# Altium schematic sheet Agrobot_2.0.SchDoc: Kapitoshka
size 594 x 420 mm; ApprovedBy: Алексеев; CheckedBy: Алексеев; DrawnBy: Подлесный; DocumentNumber: СКТБ.280317.002 Э3; SheetNumber: 1; Format: A2; DocumentType: Схема электрическая принципиальная; ImagePath: Введите номер платы
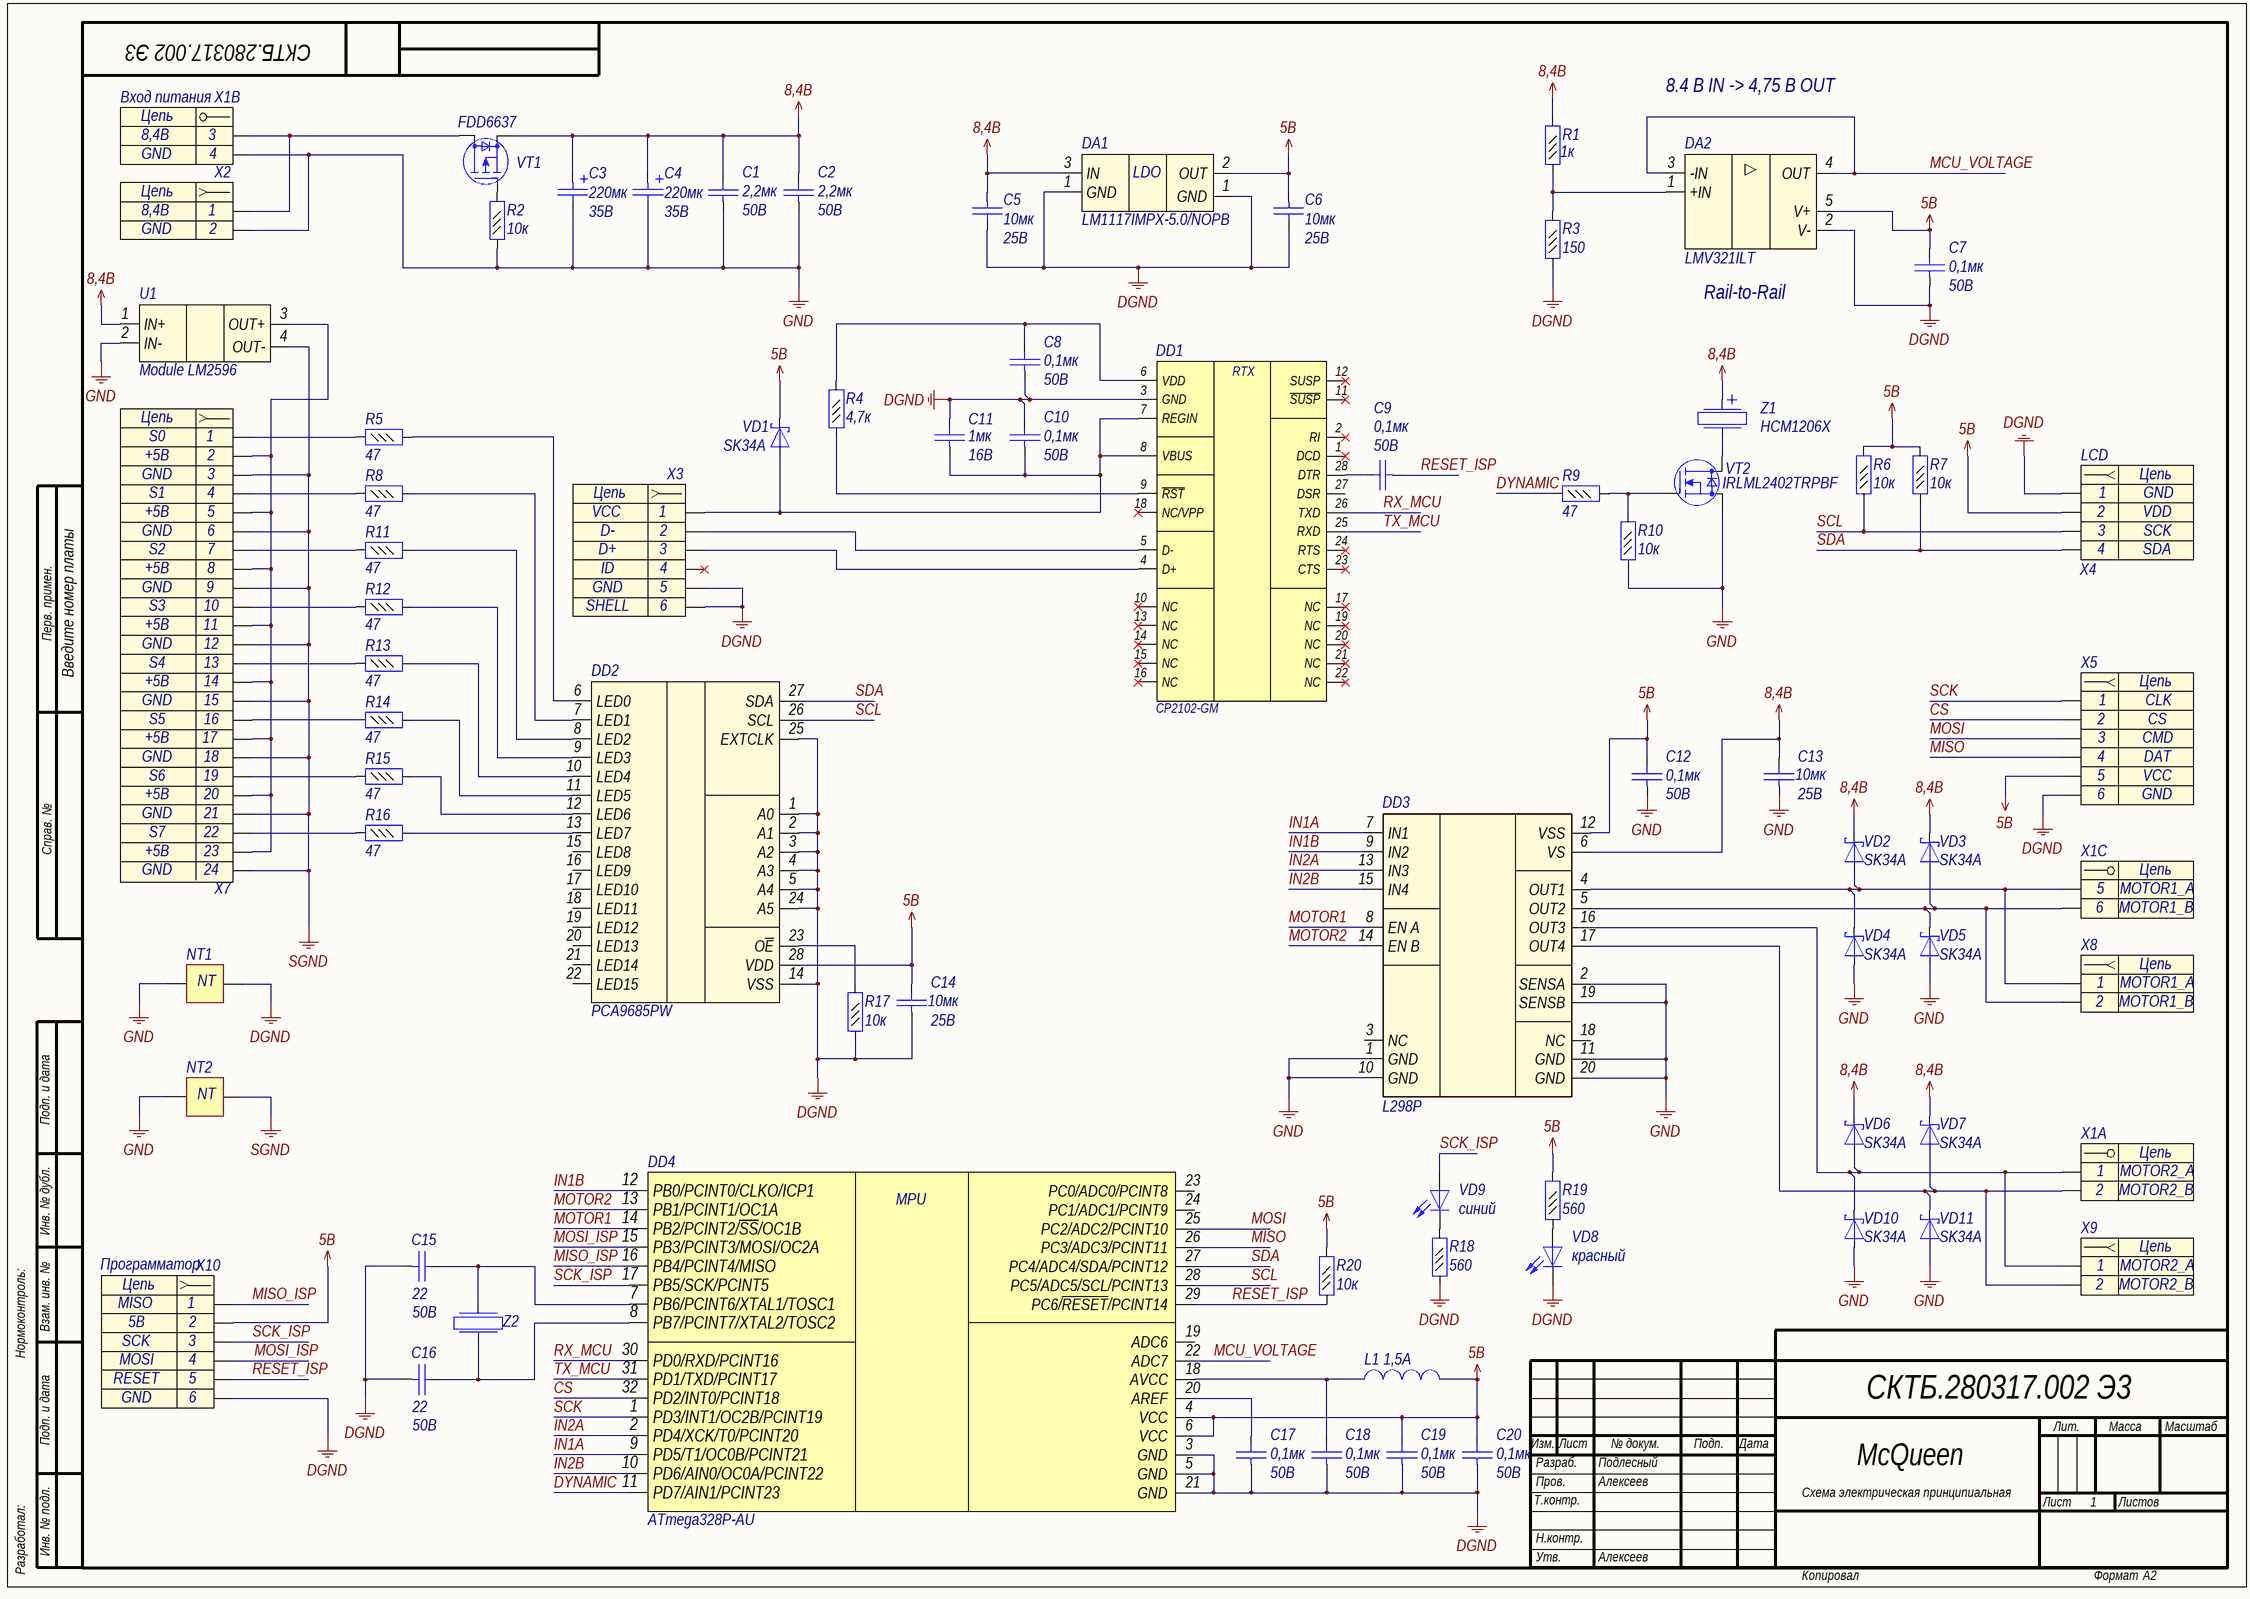
[diagram p0: Agrobot_2.0.SchDoc]

## Parts
C1  value 2,2мк  Voltage: 50В  [C1206]  (hidden comment: Capacitor)
C2  value 2,2мк  Voltage: 50В  [C1206]  (hidden comment: Capacitor)
C3  value 220мк  Voltage: 35В  [K50-35(8X11.5)_H]  (hidden comment: Capacitor_pol)
C4  value 220мк  Voltage: 35В  [K50-35(8X11.5)_H_MIRROR]  (hidden comment: Capacitor_pol)
C5  Voltage: 25В  [C1210]  (hidden comment: 10мк)
C6  Voltage: 25В  [C1210]  (hidden comment: 10мк)
C7  Voltage: 50B  [C0603]  (hidden comment: 0,1мк)
C8  Voltage: 50B  [C0603]  (hidden comment: 0,1мк)
C9  Voltage: 50B  [C0603]  (hidden comment: 0,1мк)
C10  Voltage: 50B  [C0603]  (hidden comment: 0,1мк)
C11  Voltage: 16B  [C0603]  (hidden comment: 1мк)
C12  Voltage: 50B  [C0603]  (hidden comment: 0,1мк)
C13  value 10мк  Voltage: 25В  [C1210]  (hidden comment: Capacitor)
C14  value 10мк  Voltage: 25В  [C1210]  (hidden comment: Capacitor)
C15  Voltage: 50B  [C0603]  (hidden comment: 22)
C16  Voltage: 50B  [C0603]  (hidden comment: 22)
C17  Voltage: 50B  [C0603]  (hidden comment: 0,1мк)
C18  Voltage: 50B  [C0603]  (hidden comment: 0,1мк)
C19  Voltage: 50B  [C0603]  (hidden comment: 0,1мк)
C20  Voltage: 50B  [C0603]  (hidden comment: 0,1мк)
DA1  Part Number: LM1117IMPX-5.0/NOPB  [SOT-223]  (hidden comment: LM1117IMPX)
DA2  LMV321ILT  [SOT23-5]
DD1  CP2102-GM  [QFN28]
DD2  PCA9685PW  [TSSOP28]
DD3  L298P  [POWERSO20]
DD4  ATmega328P-AU  [TQFP-32]
L1  Rated Current: 1,5A  [L0603]  (hidden comment: Inductor)
NT1  Pofigistor  [Pofigistor0603]  (value not drawn)  (net tie, no BOM)
NT2  Pofigistor  [Pofigistor0603]  (value not drawn)  (net tie, no BOM)
R1  value 1к  [R0603]  (hidden comment: Resistor_0,062Вт)
R2  value 10к  [R0603]  (hidden comment: Resistor_0,062Вт)
R3  value 150  [R0603]  (hidden comment: Resistor_0,062Вт)
R4  value 4,7к  [R0603]  (hidden comment: Resistor_0,062Вт)
R5  value 47  [R0603]  (hidden comment: Resistor_0,062Вт)
R6  value 10к  [R0603]  (hidden comment: Resistor_0,062Вт)
R7  value 10к  [R0603]  (hidden comment: Resistor_0,062Вт)
R8  value 47  [R0603]  (hidden comment: Resistor_0,062Вт)
R9  value 47  [R0603]  (hidden comment: Resistor_0,062Вт)
R10  value 10к  [R0603]  (hidden comment: Resistor_0,062Вт)
R11  value 47  [R0603]  (hidden comment: Resistor_0,062Вт)
R12  value 47  [R0603]  (hidden comment: Resistor_0,062Вт)
R13  value 47  [R0603]  (hidden comment: Resistor_0,062Вт)
R14  value 47  [R0603]  (hidden comment: Resistor_0,062Вт)
R15  value 47  [R0603]  (hidden comment: Resistor_0,062Вт)
R16  value 47  [R0603]  (hidden comment: Resistor_0,062Вт)
R17  value 10к  [R0603]  (hidden comment: Resistor_0,062Вт)
R18  value 560  [R0603]  (hidden comment: Resistor_0,062Вт)
R19  value 560  [R0603]  (hidden comment: Resistor_0,062Вт)
R20  value 10к  [R0603]  (hidden comment: Resistor_0,062Вт)
U1  Module LM2596  [module LM2596]
VD1  Part Number: SK34A  [SMA]  (hidden comment: DiodeSchottky)
VD2  Part Number: SK34A  [SMA]  (hidden comment: DiodeSchottky)
VD3  Part Number: SK34A  [SMA]  (hidden comment: DiodeSchottky)
VD4  Part Number: SK34A  [SMA]  (hidden comment: DiodeSchottky)
VD5  Part Number: SK34A  [SMA]  (hidden comment: DiodeSchottky)
VD6  Part Number: SK34A  [SMA]  (hidden comment: DiodeSchottky)
VD7  Part Number: SK34A  [SMA]  (hidden comment: DiodeSchottky)
VD8  красный  [L_0805]
VD9  синий  [L_0805]
VD10  Part Number: SK34A  [SMA]  (hidden comment: DiodeSchottky)
VD11  Part Number: SK34A  [SMA]  (hidden comment: DiodeSchottky)
VT1  Part Number: FDD6637  [DPAK]  (hidden comment: P-MOSFET)
VT2  Part Number: IRLML2402TRPBF  [SOT23-3]  (hidden comment: N-MOSFET)
X1  (no value)  [TERMINAL-6WAY-5MM]  (parts A,B,C of 3)
X2  Header_2_sct  [2HOLE_2.5]  (value not drawn)
X3  Header_6_sct  [USB_MICRO_VERT]  (value not drawn)
X4  LCD  [PLS-4HOLES]
X5  Header_6_sct  [PSP_ANTENNA]  (value not drawn)
X7  Header_24_sct  [PLS-24-3]  (value not drawn)
X8  Header_2_sct  [2HOLE_2.5]  (value not drawn)
X9  Header_2_sct  [2HOLE_2.5]  (value not drawn)
X10  Программатор  [PLS2-6]
Z1  Part Number: HCM1206X  [Buzzer_gen_12mm]
Z2  Crystal  [HC-49SM]  (value not drawn)

## Nets
5В: C6.1 C7.2 C12.2 C14.2 C19.2 C20.2 DA1.2(OUT) DA2.5(V+) DD2.28(VDD) DD3.12(VSS) DD4.4(VCC) DD4.6(VCC) L1.2 R6.2 R7.2 R19.2 R20.2 VD1.1(K) X4.2 X5.5 X10.2
8,4В: C1.2 C2.2 C3.1 C4.1 C5.1 C13.2 DA1.3(IN) DD3.6(VS) R1.2 U1.1(IN+) VD2.1(K) VD3.1(K) VD6.1(K) VD7.1(K) VT1.3(S) Z1.1
DGND: C5.2 C6.2 C7.1 C8.1 C10.2 C11.2 C14.1 C15.1 C16.1 C17.1 C18.1 C19.1 C20.1 DA1.1(GND) DA2.2(V-) DD1.3(GND) DD2.1(A0) DD2.2(A1) DD2.3(A2) DD2.4(A3) DD2.5(A4) DD2.14(VSS) DD2.24(A5) DD2.25(EXTCLK) DD4.3(GND) DD4.5(GND) DD4.21(GND) NT1.2 R3.1 R17.1 R18.1 VD8.1(K) X3.5 X3.6 X4.1 X5.6 X10.6
GND: C1.1 C2.1 C3.2 C4.2 C12.1 C13.1 DD3.1(GND) DD3.2(SENSA) DD3.10(GND) DD3.11(GND) DD3.19(SENSB) DD3.20(GND) NT1.1 NT2.1 R2.1 R10.1 U1.2(IN-) VD4.2(A) VD5.2(A) VD10.2(A) VD11.2(A) VT2.2(S) X1.4 X2.2
SGND: NT2.2 U1.4(OUT-) X7.3 X7.6 X7.9 X7.12 X7.15 X7.18 X7.21 X7.24
CS: DD4.32(PD2/INT0/PCINT18) X5.2
DYNAMIC: DD4.11(PD7/AIN1/PCINT23) R9.1
IN1A: DD3.7(IN1) DD4.9(PD5/T1/OC0B/PCINT21)
IN1B: DD3.9(IN2) DD4.12(PB0/PCINT0/CLKO/ICP1)
IN2A: DD3.13(IN3) DD4.2(PD4/XCK/T0/PCINT20)
IN2B: DD3.15(IN4) DD4.10(PD6/AIN0/OC0A/PCINT22)
MCU_VOLTAGE: DA2.3(-IN) DA2.4(OUT) DD4.22(ADC7)
MISO: DD4.26(PC3/ADC3/PCINT11) X5.4
MISO_ISP: DD4.16(PB4/PCINT4/MISO) X10.1
MOSI: DD4.25(PC2/ADC2/PCINT10) X5.3
MOSI_ISP: DD4.15(PB3/PCINT3/MOSI/OC2A) X10.4
MOTOR1: DD3.8(EN_A) DD4.14(PB2/PCINT2/~{SS}/OC1B)
MOTOR2: DD3.14(EN_B) DD4.13(PB1/PCINT1/OC1A)
RESET_ISP: C9.1 DD4.29(PC6/~{RESET}/PCINT14) R20.1 X10.5
RX_MCU: DD1.26(TXD) DD4.30(PD0/RXD/PCINT16)
SCK: DD4.1(PD3/INT1/OC2B/PCINT19) X5.1
SCK_ISP: DD4.17(PB5/SCK/PCINT5) VD9.2(A) X10.3
SCL: DD2.26(SCL) DD4.28(PC5/ADC5/SCL/PCINT13) R6.1 X4.3
SDA: DD2.27(SDA) DD4.27(PC4/ADC4/SDA/PCINT12) R7.1 X4.4
TX_MCU: DD1.25(RXD) DD4.31(PD1/TXD/PCINT17)
NetC8_2: C8.2 DD1.6(VDD) R4.2
NetC9_2: C9.2 DD1.28(DTR)
NetC10_1: C10.1 C11.1 DD1.7(REGIN) DD1.8(VBUS) VD1.2(A) X3.1
NetC15_2: C15.2 DD4.7(PB6/PCINT6/XTAL1/TOSC1) Z2.2
NetC16_2: C16.2 DD4.8(PB7/PCINT7/XTAL2/TOSC2) Z2.1
NetC17_2: C17.2 DD4.20(AREF)
NetC18_2: C18.2 DD4.18(AVCC) L1.1
NetDA2_1: DA2.1(+IN) R1.1 R3.2
NetDD1_4: DD1.4(D+) X3.3
NetDD1_5: DD1.5(D-) X3.2
NetDD1_9: DD1.9(~{RST}) R4.1
NetDD2_6: DD2.6(LED0) R5.2
NetDD2_7: DD2.7(LED1) R8.2
NetDD2_8: DD2.8(LED2) R11.2
NetDD2_9: DD2.9(LED3) R12.2
NetDD2_10: DD2.10(LED4) R13.2
NetDD2_11: DD2.11(LED5) R14.2
NetDD2_12: DD2.12(LED6) R15.2
NetDD2_13: DD2.13(LED7) R16.2
NetDD2_23: DD2.23(O~{E}) R17.2
NetDD3_4: DD3.4(OUT1) VD2.2(A) VD4.1(K) X1.5 X8.1
NetDD3_5: DD3.5(OUT2) VD3.2(A) VD5.1(K) X1.6 X8.2
NetDD3_16: DD3.16(OUT3) VD6.2(A) VD10.1(K) X1.1 X9.1
NetDD3_17: DD3.17(OUT4) VD7.2(A) VD11.1(K) X1.2 X9.2
NetR2_2: R2.2 VT1.1(G)
NetR5_1: R5.1 X7.1
NetR8_1: R8.1 X7.4
NetR9_2: R9.2 R10.2 VT2.1(G)
NetR11_1: R11.1 X7.7
NetR12_1: R12.1 X7.10
NetR13_1: R13.1 X7.13
NetR14_1: R14.1 X7.16
NetR15_1: R15.1 X7.19
NetR16_1: R16.1 X7.22
NetR18_2: R18.2 VD9.1(K)
NetR19_1: R19.1 VD8.2(A)
NetU1_3: U1.3(OUT+) X7.2 X7.5 X7.8 X7.11 X7.14 X7.17 X7.20 X7.23
NetVT1_2: VT1.2(D) X1.3 X2.1
NetVT2_3: VT2.3(D) Z1.2

Not connected (* = marked no-connect by the designer): DD1 1(DCD)* 2(RI)* 10(NC)* 11(~{SUSP})* 12(SUSP)* 13(NC)* 14(NC)* 15(NC)* 16(NC)* 17(NC)* 18(NC/VPP)* 19(NC)* 20(NC)* 21(NC)* 22(NC)* 23(CTS)* 24(RTS)* 27(DSR); DD2 15(LED8) 16(LED9) 17(LED10) 18(LED11) 19(LED12) 20(LED13) 21(LED14) 22(LED15); DD3 3(NC) 18(NC); DD4 19(ADC6) 23(PC0/ADC0/PCINT8) 24(PC1/ADC1/PCINT9); X3 4*

## Notes on the sheet
- 8.4 B IN -> 4,75 B OUT
- Rail-to-Rail
- Перв. примен.
- Справ. №
- Подп. и дата
- Инв. № дубл.
- Нормоконтроль:
- Взам. инв. №
- Изм.
- Лист
- № докум.
- Подп.
- Дата
- Лит.
- Масса
- Масштаб
- Т.контр.
- Пров.
- Разраб.
- McQueen
- Листов
- Разработал:
- Инв. № подл.
- Н.контр.
- Утв.
- Копировал
- Формат
- (in symbol connect0) Цепь
- (in symbol connect9) Цепь
- (in symbol connect10) Цепь
- (in symbol connect11) Цепь
- (in symbol connect11, part A) Цепь
- (in symbol connect11, part B) Цепь
- (in symbol connect11, part C) Цепь
- (in symbol connect13) Цепь
- (in symbol connect131) Цепь
- (in symbol interf33) RTX
- (in symbol microcont1) MPU
- (in symbol pwr129) LDO
- (in symbol res1930) NT

## Library data of the parts
C1 C2 = cap187: Конденсатор; Part Name: Ceramic; Manufacture: Murata; Part Number: GRM31CR71H225KA88**L; id: cap187; TKE: X7R
C3 = cap221: Конденсатор полярный; Part Name: Electrolit; Manufacture: Jamicon; Part Number: TKR221M1VF11; id: cap221; tga: 0,20%
C4 = cap222: Конденсатор полярный; Part Name: Electrolit; Manufacture: Jamicon; Part Number: TKR221M1VF11; id: cap222; tga: 0,20%
C5 C6 = cap193: Конденсатор; Part Name: Ceramic; Manufacture: Murata; Part Number: GRM32ER61A106K; id: cap193; TKE: X7R; Value: 10мк
C7-C10 C12 C17-C20 = cap131: Конденсатор; Part Name: Ceramic; Manufacture: Murata; Part Number: GRM188R71H104KA93D; id: cap131; TKE: X7R; Value: 0,1мк
C11 = cap133: Конденсатор; Part Name: Ceramic; Manufacture: Murata; Part Number: GRM188R71C105KA12D**; id: cap133; TKE: X7R; Value: 1мк
C13 C14 = cap194: Конденсатор; Part Name: Capacitors; Part Number: GRM32ER61A106K; id: cap194; TKE: X7R
C15 C16 = cap77: Конденсатор; Part Name: Ceramic; Manufacture: Yageo; Part Number: CC0603JRNPO9BN220; id: cap77; TKE: NP0; Value: 22
DA1 = pwr129: Low-Dropout Regulator for 5-V to 3.3-V Conversion; Part Name: Linear Regulator with a dropout of 5V at 800mA; Manufacturer: Texas Instruments; id: pwr129; Input Voltage: 15B; Output Voltage: 5B; Dropout Voltage: 1,2B; Current: 800mA; Type: Linear
DA2 = amp10: HIGH-DRIVE OPERATIONAL AMPLIFIERS WITH SHUTDOWN; Part Name: Micropower / Operational Amplifiers; Manufacture: ST Microelectronics; id: amp10; Rail-to-rail: yes; Supply Voltage: 2,7-6B; Supply Current max: 200uA; Bandwidth: 1MHz; Input Bias Current: 10nA; CMRR: 85dB; PSRR: 80dB; Offset voltage: 0,1mB; Channels: 1; Part Number: LMV321ILT
DD1 = interf33: USB-UART преобразователь; Part Name: USB 2.0 - UART; Manufacture: Silicon Laboratories; Type Supply: Single Polar; Current Consumption: 0,02A; Power Supply: 3-3.6V; id: interf33; Part Number: CP2102-GM
DD2 = driver0: Драйвер светодиода, 16 выходов; Part Name: LED Driver; Operating Supply Voltage: 3,3B; Min Operating Supply Voltage: 2,3B; Max Operating Supply Voltage: 5,5B; Max Supply Current: 10000uA; Maximum Power Dissipation: 400mW; id: driver0
DD3 = driver1: FULL BRIDGE DC MOTOR DRIVER; Logic Voltage: 4,5-5-7B; Max Operating Supply Voltage: 46B; Maximum Power Dissipation: 25W; id: driver1; Part Name: Motor Driver
DD4 = microcont1: Микроконтроллер 8-Бит, picoPower, AVR, 20МГц, 32КБ Flash; Part Name: Microcontroller; Frequency: 20MHz; ADC: 8x10b; Interface: i2c, spi, uart; Flash: 32kb; Pin in: 23; Power Supply: 1.8-5.5 V; id: microcont1; Part Number: ATmega328P-AU
L1 = ind0: EMI Suppression Filter; Part Name: EMI Suppression Filters; Part Number: BLM18PG181SN1D; id: ind0; Resistance: 0,09Ohm
NT1 NT2 = res1930: Value: 0; id: res1930; Part Name: Pofigistor
R1 = res463: Резистор; Manufacture: Yageo; Part Number: RC0603FR-071KL; id: res463; Accuracy: 0,01; Part Name: Resistor; Power: 0,062Вт
R2 R6 R7 R10 R17 R20 = res487: Резистор; Manufacture: Yageo; Part Number: RC0603FR-0710KL; id: res487; Accuracy: 0,01; Part Name: Resistor; Power: 0,062Вт
R3 = res443: Резистор; Manufacture: Yageo; Part Number: RC0603FR-07150RL; id: res443; Accuracy: 0,01; Part Name: Resistor; Power: 0,062Вт
R4 = res479: Резистор; Manufacture: Yageo; Part Number: RC0603FR-074K7; id: res479; Accuracy: 0,01; Part Name: Resistor; Power: 0,062Вт
R5 R8 R9 R11-R16 = res431: Резистор; Manufacture: Yageo; Part Number: RC0603FR-0747RL; id: res431; Accuracy: 0,01; Part Name: Resistor; Power: 0,062Вт
R18 R19 = res457: Резистор; Manufacture: Yageo; Part Number: RC0603FR-07560RL; id: res457; Accuracy: 0,01; Part Name: Resistor; Power: 0,062Вт
U1 = module0: Low-Dropout Regulator for 5-V to 3.3-V Conversion; id: module0; Part Name: LM2596
VD1-VD7 VD10 VD11 = SK34A: Диод Шоттки; id: diode2; Backward Voltage: 40B; Forward Voltage: 0,55B; Forward Current: 3A; Part Name: Diode Schottky
VD8 = diode5: Светодиод; Part Name: LED red; Part Number: KP-2012EC; Manufacture: Kingbright; id: diode5
VD9 = diode37: Светодиод; Part Name: LED green; Part Number: KP-2012MGC; Manufacture: Kingbright; id: diode37
VT1 = trans8: N-MOSFET; Manufacturer: Fairchild Semiconductor; id: trans8; Structure: p-channel; V drain-source max: (-35B); Rds: 0,0116Ohm; Gate-to-source voltage: (+-)25B; Continuous drain current: (-55)A; Pulsed drain current: (-100)A; Power dissipation: 57W
VT2 = IRLML2402TRPBF: Part Name: Transistor; id: trans2; Structure: n-channel; V drain-source max: 20B; Rds: 0,25Ohm; Gate-to-source voltage: (+-)12B; Continuous drain current: 1,2A; Pulsed drain current: 7,4A; Power dissipation: 0,54W
X1 = connect11: POWER; Part Name: TERMINAL BLOCK 6 way; Contact_2: MOTOR2_B; Contact_1: MOTOR2_A; Etch: 5mm; Contact_5: Contact_5; Contact_6: Contact_6; Contact_4: Contact_4; Contact_3: Contact_3; id: connect11
X2 = connect10: Разъем - 2 конт. розетка; Part Name: Hole for connector; Contact_1: 8,4B; Contact_2: GND; id: connect10
X3 = connect131: Разъем - 6 конт. розетка; Part Name: USB Micro Vertical; Part Number: MK5P; Contact_1: VCC; Contact_2: D-; Contact_3: D+; Contact_4: ID; Contact_5: GND; Contact_6: SHELL; id: connect131
X4 = connect11: Разъем - 4 конт. розетка; Part Name: Hole for connector; Contact_1: GND; Contact_2: VDD; Contact_3: SCK; Contact_4: SDA; id: connect11
X5 = connect13: Разъем - 6 конт. розетка; Part Name: PSP Antenna Joystick; Contact_1: CLK; Contact_2: CS; Contact_3: CMD; Contact_4: DAT; Contact_5: VCC; Contact_6: GND; id: connect13
X7 = connect9: Разъем - 5 конт. розетка; Part Name: PLS-24 3way; Contact_1: S0; Contact_2: +5B; Contact_3: GND; Contact_4: S1; Contact_7: S2; Contact_10: S3; Contact_13: S4; Contact_16: S5; Contact_19: S6; Contact_22: S7; Contact_5: +5B; Contact_6: GND; id: connect9; Contact_8: +5B; Contact_9: GND; Contact_11: +5B; Contact_12: GND; Contact_14: +5B; Contact_15: GND; Contact_17: +5B; Contact_18: GND; Contact_20: +5B; Contact_21: GND; Contact_23: +5B; Contact_24: GND
X8 = connect10: Разъем - 2 конт. розетка; Part Name: Hole for connector; Contact_1: MOTOR1_A; Contact_2: MOTOR1_B; id: connect10
X9 = connect10: Разъем - 2 конт. розетка; Part Name: Hole for connector; Contact_1: MOTOR2_A; Contact_2: MOTOR2_B; id: connect10
X10 = connect0: Разъем - 6 конт. розетка; Part Name: MKII; Contact_1: MISO; Contact_2: 5B; Contact_3: SCK; Contact_4: MOSI; Contact_5: RESET; Contact_6: GND; id: connect0
Z1 = buzzer2: Пьезоизлучатель звуковой без генератора; Frequence: 2300Hz; Generator: yes; Intensity: 85dB; Supply Voltage: 12B; Max  Current: 30mA; id: buzzer2
Z2 = crystal16: Кварцевый резонатор; Manufacture: Китай; Part Number: 16.000MHzHC-49SM; Frequence: 16MHz; id: crystal16